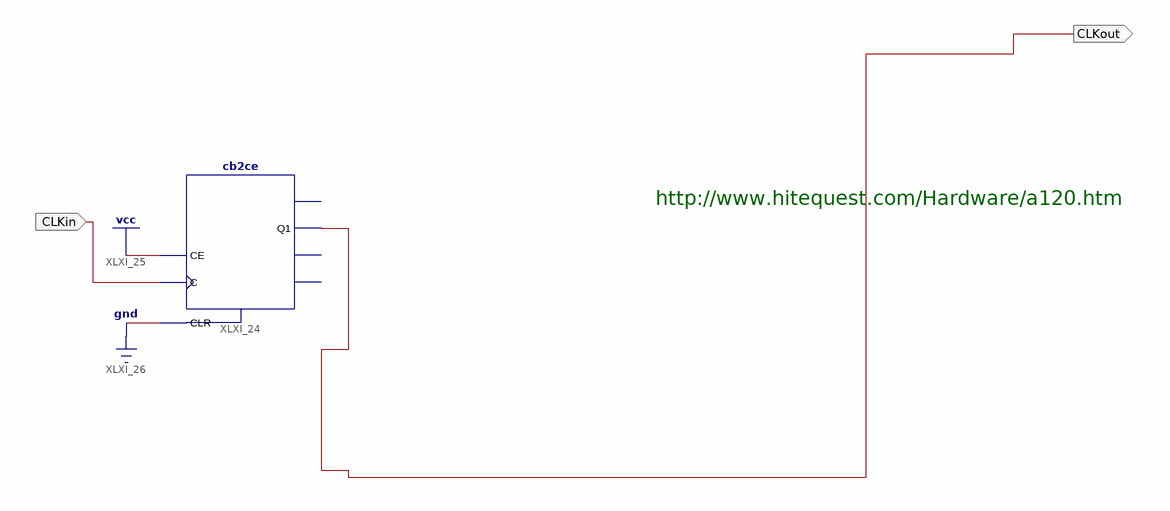
[diagram p0: schematic sheet 1]
// Xilinx ISE schematic divideby4.sch (artix7) as structural Verilog: 1 symbols, 2 ports
module divideby4 (
  input  CLKin,
  output CLKout
);

  cb2ce XLXI_24 (.C(CLKin), .CE(1'b1), .CLR(1'b0), .Q1(CLKout));  // open: CEO, Q0, TC

  // Notes on the sheet:
  //   http://www.hitequest.com/Hardware/a120.htm
endmodule
